# Altium schematic sheet USB.SchDoc
size A4
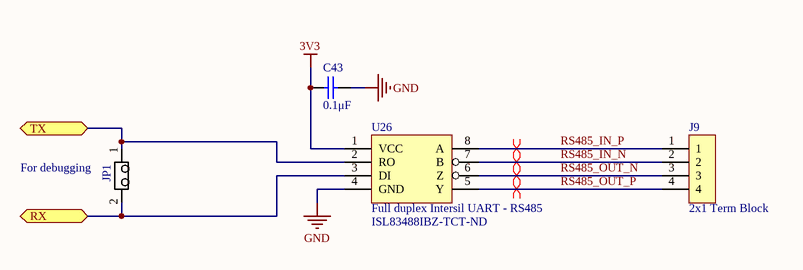
[diagram p0: USB.SchDoc]

## Parts
C43  0.1μF  [CAPC1608N(0603")]
J9  2x1 Term Block  [4X1 Terminal Block]
JP1  1X2 Pin Head  [2X1 Males Header]  (value not drawn)
U26  Full duplex Intersil UART - RS485  Supplier Part Number 1: ISL83488IBZ-TCT-ND  [SOIC-SN8_M]

## Ports
RX, TX

## Nets
3V3: C43.2(Cathode) U26.1(VCC)
GND: C43.1(Anode) U26.4(GND)
RS485_IN_N: J9.2 U26.7(B)
RS485_IN_P: J9.1 U26.8(A)
RS485_OUT_N: J9.3 U26.6(Z)
RS485_OUT_P: J9.4 U26.5(Y)
RX: JP1.2 U26.3(DI) ; port RX
TX: JP1.1 U26.2(RO) ; port TX

## Layout directives
differential pair: RS485_IN_N, RS485_IN_P, RS485_OUT_N, RS485_OUT_P

## Notes on the sheet
- (near JP1) For debugging

## Library data of the parts
C43 = 0.1uF 100V 0603 SMD, Ceramic: Capacitor, Ceramic, 100V, +/- 10%, 0603 SMD, X7R; MFG: TDK; MFG#: CGA3E3X7S2A104K080AB; Published: 16-04-26; Publisher: AUVic; PackageDescription: Chip Capacitor; Value: 0.1μF; Created By: Ashwin Sira; Supplier 1: Digi-Key; Supplier Part Number 1: 445-6938-1-ND
J9 = 4x1 Terminal Block: Made by: Andy Bates; Supplier 1: Digikey; Supplier Part Number 1: ED2742-ND
JP1 = 1x2 Male Header: Made By: Andy Bates; Supplier 1: Digi-Key; Supplier Part Number 1: 952-3073-ND
U26 = Full duplex Intersil UART - RS485: Made By: Andy Bates; Created On: 2016/09/08; Supplier 1: Digi-Key